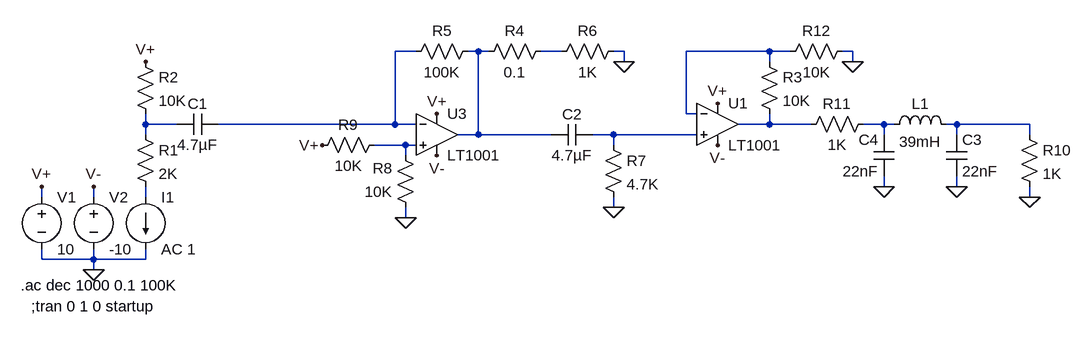
[diagram p0: schematic preAmp.asc]
preAmp.asc, the LTspice schematic file:
Version 4
SHEET 1 1208 680
WIRE 176 0 144 0
WIRE 272 0 256 0
WIRE 288 0 272 0
WIRE 400 0 368 0
WIRE 496 0 480 0
WIRE 720 0 592 0
WIRE 752 0 720 0
WIRE 848 0 832 0
WIRE 496 16 496 0
WIRE 720 16 720 0
WIRE 848 16 848 0
WIRE 592 96 592 0
WIRE 608 96 592 96
WIRE -240 112 -240 96
WIRE -192 112 -240 112
WIRE 144 112 144 0
WIRE 144 112 -128 112
WIRE 176 112 144 112
WIRE 720 112 720 96
WIRE 720 112 672 112
WIRE 784 112 720 112
WIRE 896 112 864 112
WIRE 912 112 896 112
WIRE 1008 112 992 112
WIRE 1120 112 1008 112
WIRE -240 128 -240 112
WIRE 272 128 272 0
WIRE 272 128 240 128
WIRE 384 128 272 128
WIRE 480 128 448 128
WIRE 608 128 480 128
WIRE 896 128 896 112
WIRE 1008 128 1008 112
WIRE 1120 128 1120 112
WIRE 160 144 112 144
WIRE 176 144 160 144
WIRE 480 144 480 128
WIRE 160 160 160 144
WIRE 896 208 896 192
WIRE 1008 208 1008 192
WIRE -400 224 -400 208
WIRE -320 224 -320 208
WIRE -240 224 -240 208
WIRE 1120 224 1120 208
WIRE 480 240 480 224
WIRE 160 256 160 240
WIRE -400 320 -400 304
WIRE -320 320 -320 304
WIRE -320 320 -400 320
WIRE -240 320 -240 304
WIRE -240 320 -320 320
WIRE -320 336 -320 320
FLAG -320 336 0
FLAG -400 208 V+
FLAG -320 208 V-
FLAG 208 160 V-
FLAG 208 96 V+
FLAG -240 16 V+
FLAG 496 16 0
FLAG 480 240 0
FLAG 160 256 0
FLAG 32 144 V+
FLAG 640 144 V-
FLAG 640 80 V+
FLAG 1008 208 0
FLAG 1120 224 0
FLAG 896 208 0
FLAG 848 16 0
SYMBOL voltage -400 208 R0
SYMATTR InstName V1
SYMATTR Value 10
SYMBOL voltage -320 208 R0
SYMATTR InstName V2
SYMATTR Value -10
SYMBOL res -256 112 R0
SYMATTR InstName R1
SYMATTR Value 2K
SYMBOL res -256 0 R0
SYMATTR InstName R2
SYMATTR Value 10K
SYMBOL current -240 224 R0
WINDOW 123 0 0 Left 2
WINDOW 39 0 0 Left 2
SYMATTR InstName I1
SYMATTR Value AC 1
SYMBOL cap -128 96 R90
WINDOW 0 0 32 VBottom 2
WINDOW 3 32 32 VTop 2
SYMATTR InstName C1
SYMATTR Value 4.7µF
SYMBOL res 384 -16 R90
WINDOW 0 0 56 VBottom 2
WINDOW 3 32 56 VTop 2
SYMATTR InstName R4
SYMATTR Value 0.1
SYMBOL res 272 -16 R90
WINDOW 0 0 56 VBottom 2
WINDOW 3 32 56 VTop 2
SYMATTR InstName R5
SYMATTR Value 100K
SYMBOL res 496 -16 R90
WINDOW 0 0 56 VBottom 2
WINDOW 3 32 56 VTop 2
SYMATTR InstName R6
SYMATTR Value 1K
SYMBOL cap 448 112 R90
WINDOW 0 0 32 VBottom 2
WINDOW 3 32 32 VTop 2
SYMATTR InstName C2
SYMATTR Value 4.7µF
SYMBOL res 464 128 R0
SYMATTR InstName R7
SYMATTR Value 4.7K
SYMBOL res 176 256 R180
WINDOW 0 36 76 Left 2
WINDOW 3 36 40 Left 2
SYMATTR InstName R8
SYMATTR Value 10K
SYMBOL res 16 160 R270
WINDOW 0 32 56 VTop 2
WINDOW 3 0 56 VBottom 2
SYMATTR InstName R9
SYMATTR Value 10K
SYMBOL ind 896 128 R270
WINDOW 0 32 56 VTop 2
WINDOW 3 5 56 VBottom 2
SYMATTR InstName L1
SYMATTR Value 39mH
SYMBOL cap 992 128 R0
SYMATTR InstName C3
SYMATTR Value 22nF
SYMBOL res 1104 112 R0
SYMATTR InstName R10
SYMATTR Value 1K
SYMBOL res 880 96 R90
WINDOW 0 0 56 VBottom 2
WINDOW 3 32 56 VTop 2
SYMATTR InstName R11
SYMATTR Value 1K
SYMBOL cap 912 192 R180
WINDOW 0 24 56 Left 2
WINDOW 3 24 8 Left 2
SYMATTR InstName C4
SYMATTR Value 22nF
SYMBOL res 704 0 R0
SYMATTR InstName R3
SYMATTR Value 10K
SYMBOL res 848 -16 R90
WINDOW 0 0 56 VBottom 2
WINDOW 3 32 56 VTop 2
SYMATTR InstName R12
SYMATTR Value 10K
SYMBOL Opamps\\LT1001 208 64 R0
SYMATTR InstName U3
SYMBOL Opamps\\LT1001 640 48 R0
SYMATTR InstName U1
TEXT -432 360 Left 2 !.ac dec 1000 0.1 100K
TEXT -416 392 Left 2 !;tran 0 1 0 startup

The netlist it stands for:
* preAmp.asc
V1 V+ 0 10
V2 V- 0 -10
R1 N005 N011 2K
R2 V+ N005 10K
I1 N011 0 AC 1
C1 N001 N005 4.7µF
R4 N003 N002 0.1
R5 N002 N001 100K
R6 0 N003 1K
C2 N009 N002 4.7µF
R7 N009 0 4.7K
R8 0 N010 10K
R9 V+ N010 10K
L1 N007 N008 39mH
C3 N008 0 22nF
R10 N008 0 1K
R11 N007 N006 1K
C4 0 N007 22nF
R3 N004 N006 10K
R12 0 N004 10K
XU3 N010 N001 V+ V- N002 LT1001  ; pins In+ In- V+ V- OUT
XU1 N009 N004 V+ V- N006 LT1001  ; pins In+ In- V+ V- OUT
.ac dec 1000 0.1 100K
;tran 0 1 0 startup
.lib LTC.lib
.backanno
.end